# EasyEDA Pro project Haptics_4x4_R4_12VDC.epro

# Schematic Schematic1
Assembly Variant: Basic; Board Name: Board1; Create Date: 2026-09-24; Page Name: P1; Project Name: New Project_2026-09-24_15-26-25; Schematic Name: Schematic1; Update Date: 2026-09-24; Company: 嘉立创EDA; Page Size: A4; Version: V1.0
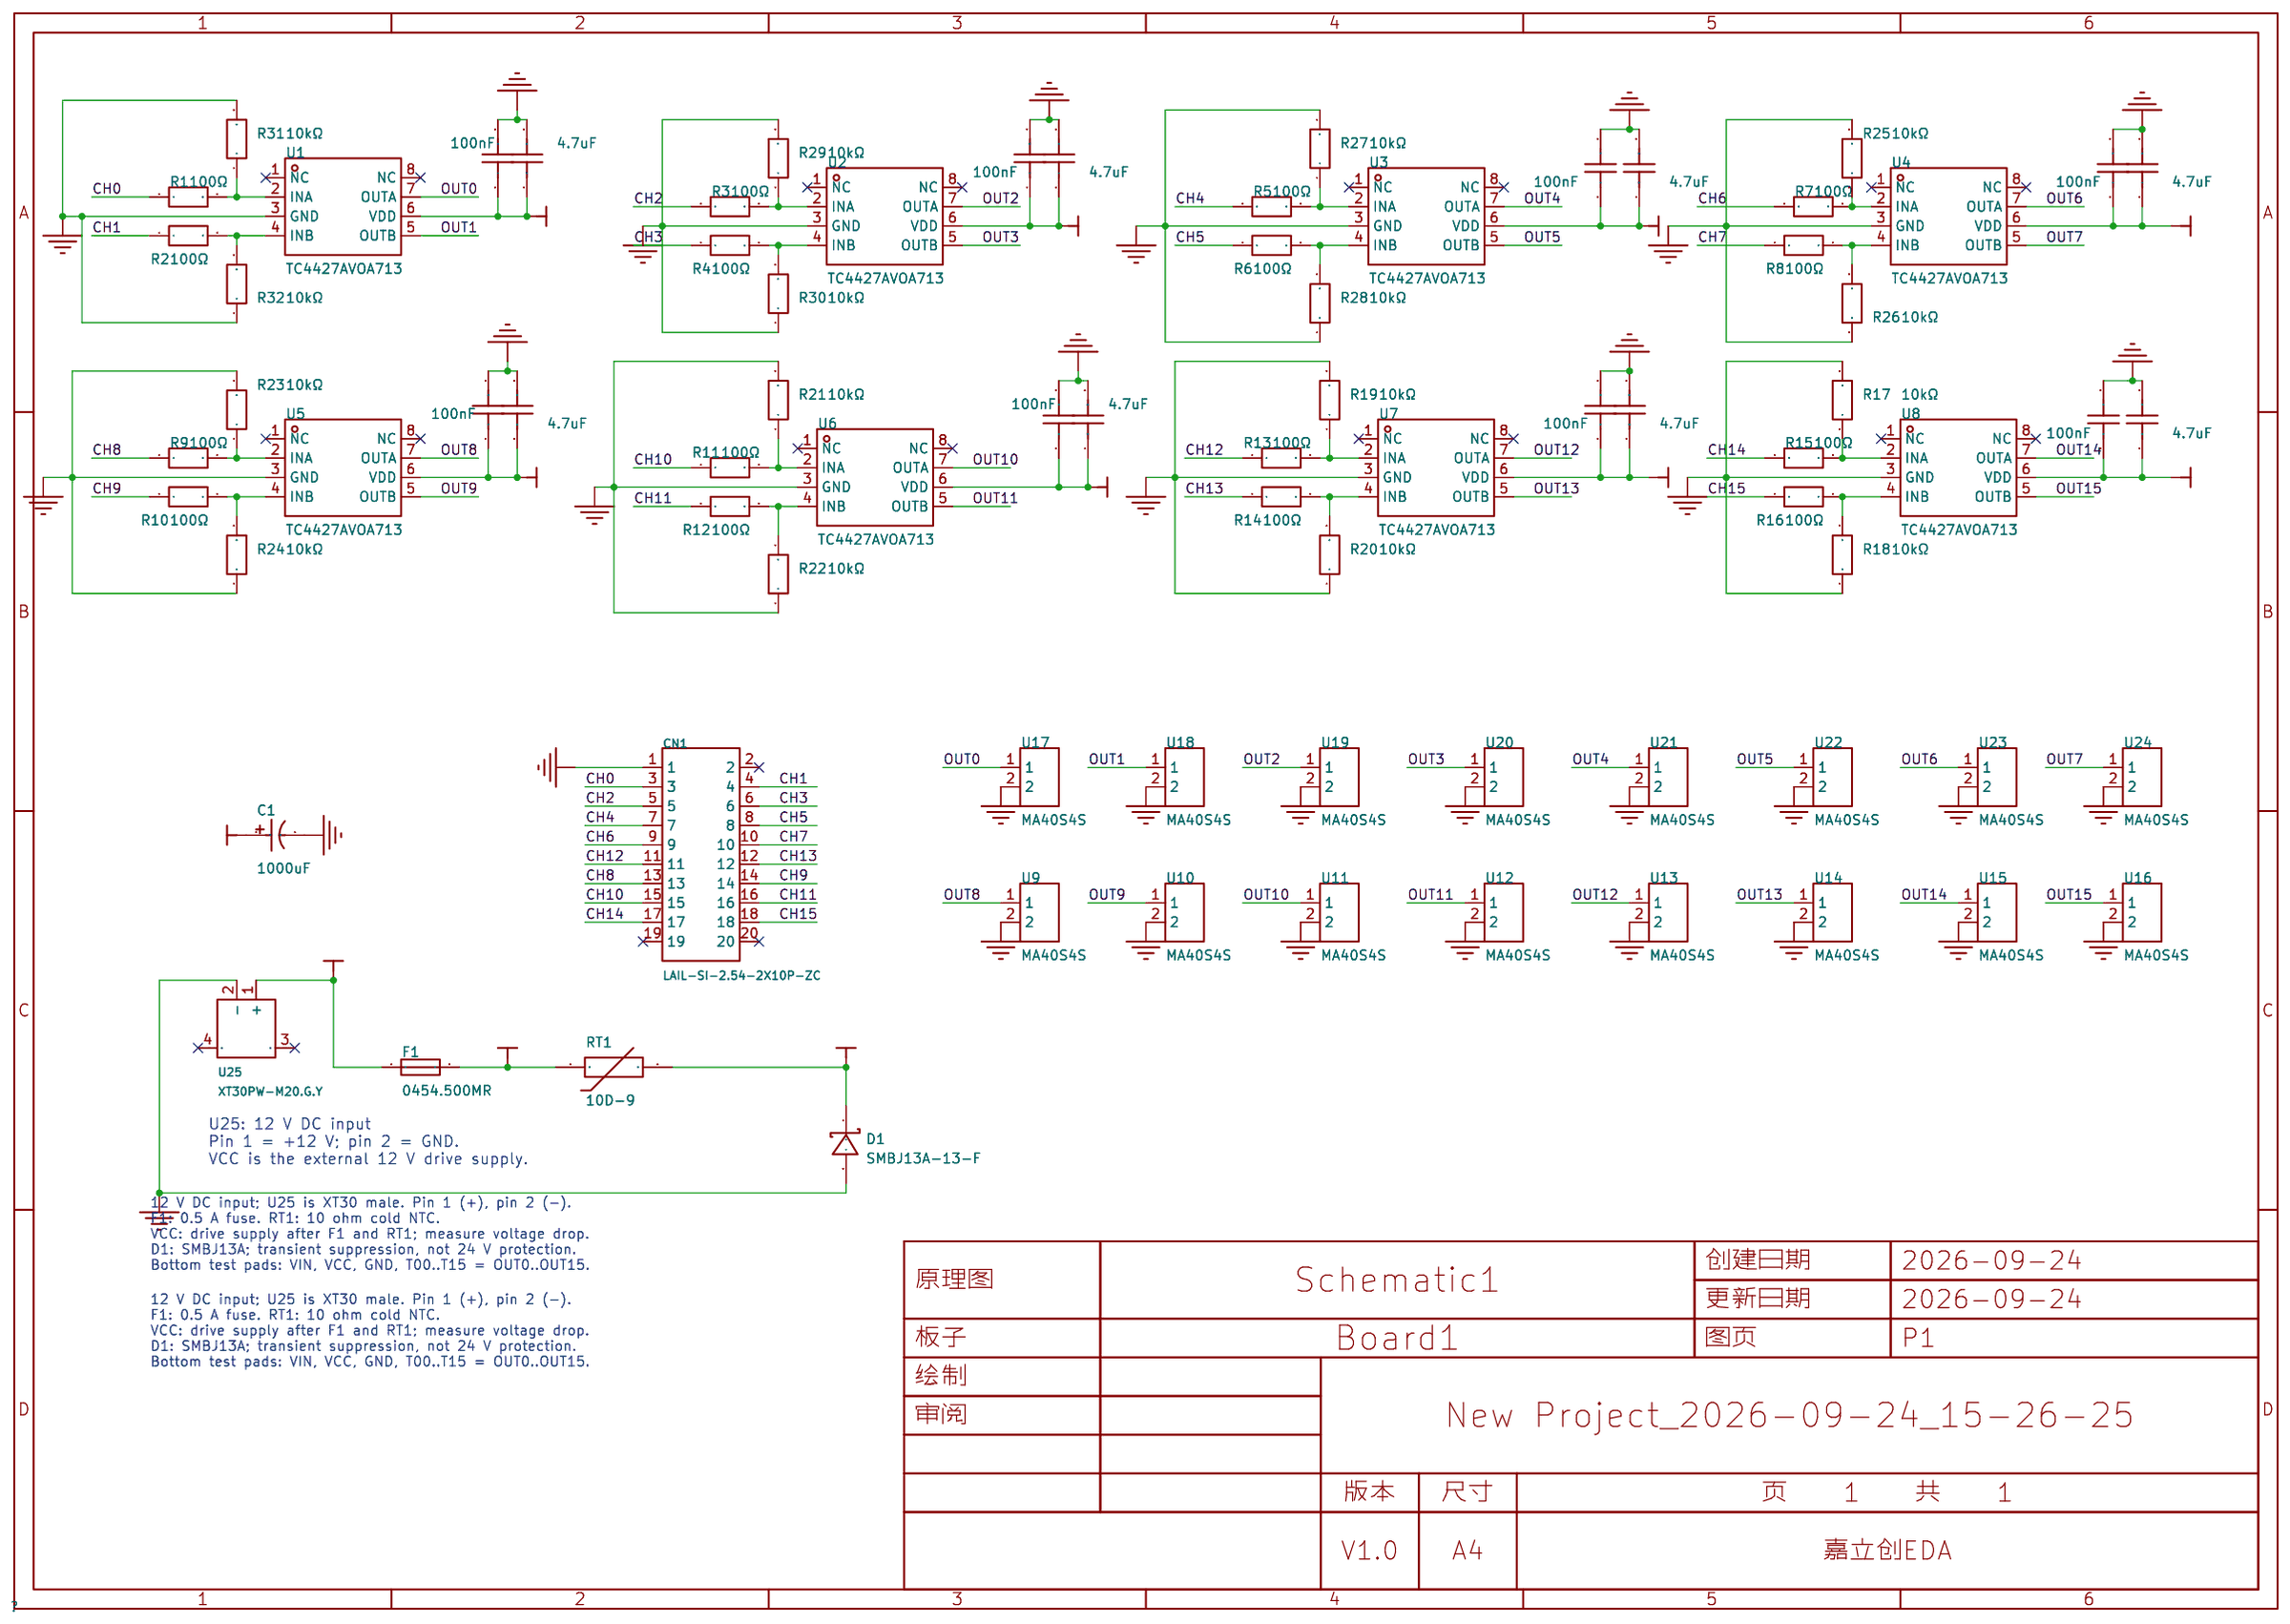
[diagram p0: schematic sheet]

## Parts
C1  1000uF  [CAP-TH_BD12.5-P5.00-D0.6-FD]
C2  100nF  [C0805]
C3  4.7uF  [C0805]
C4  100nF  [C0805]
C5  4.7uF  [C0805]
C6  100nF  [C0805]
C7  4.7uF  [C0805]
C8  100nF  [C0805]
C9  4.7uF  [C0805]
C10  100nF  [C0805]
C11  4.7uF  [C0805]
C12  100nF  [C0805]
C13  4.7uF  [C0805]
C14  100nF  [C0805]
C15  4.7uF  [C0805]
C16  100nF  [C0805]
C17  4.7uF  [C0805]
CN1  LAIL-SI-2.54-2X10P-ZC  [CONN-TH_LAIL-SI-2.54-2X10P-ZC]
D1  SMBJ13A-13-F  [SMB_L4.6-W3.6-LS5.3-RD]
F1  0454.500MR  [FUSE-SMD_L6.1-W2.7]
R1  100Ω  [R0603]
R2  100Ω  [R0603]
R3  100Ω  [R0603]
R4  100Ω  [R0603]
R5  100Ω  [R0603]
R6  100Ω  [R0603]
R7  100Ω  [R0603]
R8  100Ω  [R0603]
R9  100Ω  [R0603]
R10  100Ω  [R0603]
R11  100Ω  [R0603]
R12  100Ω  [R0603]
R13  100Ω  [R0603]
R14  100Ω  [R0603]
R15  100Ω  [R0603]
R16  100Ω  [R0603]
R17  10kΩ  [R0603]
R18  10kΩ  [R0603]
R19  10kΩ  [R0603]
R20  10kΩ  [R0603]
R21  10kΩ  [R0603]
R22  10kΩ  [R0603]
R23  10kΩ  [R0603]
R24  10kΩ  [R0603]
R25  10kΩ  [R0603]
R26  10kΩ  [R0603]
R27  10kΩ  [R0603]
R28  10kΩ  [R0603]
R29  10kΩ  [R0603]
R30  10kΩ  [R0603]
R31  10kΩ  [R0603]
R32  10kΩ  [R0603]
RT1  10D-9  [RES-TH_L10.5-W5.5-P7.50-D0.6-S5.50]
U1  TC4427AVOA713  [SOIC-8_L4.9-W3.9-P1.27-LS6.0-BL]
U2  TC4427AVOA713  [SOIC-8_L4.9-W3.9-P1.27-LS6.0-BL]
U3  TC4427AVOA713  [SOIC-8_L4.9-W3.9-P1.27-LS6.0-BL]
U4  TC4427AVOA713  [SOIC-8_L4.9-W3.9-P1.27-LS6.0-BL]
U5  TC4427AVOA713  [SOIC-8_L4.9-W3.9-P1.27-LS6.0-BL]
U6  TC4427AVOA713  [SOIC-8_L4.9-W3.9-P1.27-LS6.0-BL]
U7  TC4427AVOA713  [SOIC-8_L4.9-W3.9-P1.27-LS6.0-BL]
U8  TC4427AVOA713  [SOIC-8_L4.9-W3.9-P1.27-LS6.0-BL]
U9  MA40S4S  [SENSOR-TH_BD9.9-P5.00-D0.7_MA40S4S]
U10  MA40S4S  [SENSOR-TH_BD9.9-P5.00-D0.7_MA40S4S]
U11  MA40S4S  [SENSOR-TH_BD9.9-P5.00-D0.7_MA40S4S]
U12  MA40S4S  [SENSOR-TH_BD9.9-P5.00-D0.7_MA40S4S]
U13  MA40S4S  [SENSOR-TH_BD9.9-P5.00-D0.7_MA40S4S]
U14  MA40S4S  [SENSOR-TH_BD9.9-P5.00-D0.7_MA40S4S]
U15  MA40S4S  [SENSOR-TH_BD9.9-P5.00-D0.7_MA40S4S]
U16  MA40S4S  [SENSOR-TH_BD9.9-P5.00-D0.7_MA40S4S]
U17  MA40S4S  [SENSOR-TH_BD9.9-P5.00-D0.7_MA40S4S]
U18  MA40S4S  [SENSOR-TH_BD9.9-P5.00-D0.7_MA40S4S]
U19  MA40S4S  [SENSOR-TH_BD9.9-P5.00-D0.7_MA40S4S]
U20  MA40S4S  [SENSOR-TH_BD9.9-P5.00-D0.7_MA40S4S]
U21  MA40S4S  [SENSOR-TH_BD9.9-P5.00-D0.7_MA40S4S]
U22  MA40S4S  [SENSOR-TH_BD9.9-P5.00-D0.7_MA40S4S]
U23  MA40S4S  [SENSOR-TH_BD9.9-P5.00-D0.7_MA40S4S]
U24  MA40S4S  [SENSOR-TH_BD9.9-P5.00-D0.7_MA40S4S]
U25  XT30PW-M20.G.Y  [XT30-TH_XT30PW-M20.G.Y]

## Library data of the parts
C1 = EEUFR1V102: 容值:1000uF;精度:±20%;额定电压:35V;纹波电流:2.6A@100kHz;等效串联电阻(ESR):18mΩ@100kHz;; LCSC Part Name: 1000uF ±20% 35V; Supplier Part: C128518; Manufacturer: PANASONIC(松下); Supplier Footprint: 插件,D12.5xL20mm; JLCPCB Part Class: Extended Part; Datasheet: https://item.szlcsc.com/datasheet/EEUFR1V102/139803.html; Supplier: LCSC; Tolerance: ±20%; Voltage Rating: 35V; Ripple Current: 2.6A@100kHz; Equivalent Series Resistance(ESR): 18mΩ@100kHz; Pin Spacing: 5mm; Diameter: 12.5mm; Height - Seated (Max): 20mm; Lifetime: 10000hrs@105℃; Operating Temperature: -40℃~+105℃; Polarity type: 有极性
C2 C4 C6 C8 C10 C12 C14 C16 = FCC0805B104K500DT: 容值:100nF;精度:±10%;额定电压:50V;温度系数:X7R;; LCSC Part Name: 100nF ±10% 50V; Supplier Part: C5137467; Manufacturer: FOJAN(富捷); Supplier Footprint: 0805; JLCPCB Part Class: Extended Part; Datasheet: https://item.szlcsc.com/datasheet/FCC0805B104K500DT/5746969.html; Supplier: LCSC; Tolerance: ±10%; Voltage Rating: 50V; Temperature Coefficient: X7R; Operating Temperature: -55℃~+125℃
C3 C5 C7 C9 C11 C13 C15 C17 = HGC0805R7475K500NSLJ: 容值:4.7uF;精度:±10%;额定电压:50V;温度系数:X7R;; LCSC Part Name: 4.7uF ±10% 50V; Supplier Part: C7472970; Manufacturer: Chinocera(华瓷); Supplier Footprint: 0805; JLCPCB Part Class: Extended Part; Datasheet: https://item.szlcsc.com/datasheet/HGC0805R7475K500NSLJ/8532817.html; Supplier: LCSC; Tolerance: ±10%; Voltage Rating: 50V; Temperature Coefficient: X7R
CN1 = LAIL-SI-2.54-2X10P-ZC: 连接器类型:简牛座;间距:2.54mm;额定电流:3A;安装方式:直插;行距:2.54mm;排数:2;每排PIN数:10;触头材质:黄铜;触头镀层:金;工作温度:-40℃~+105℃;; LCSC Part Name: 2.54mm 排数:2 每排P数:10; Supplier Part: C55118382; Manufacturer: LAILAN(莱联); Supplier Footprint: 插件,P=2.54mm; JLCPCB Part Class: Extended Part; Datasheet: https://item.szlcsc.com/datasheet/LAIL-SI-2.54-2X10P-ZC/58822692.html; Supplier: LCSC; Connector Type: 简牛座; Pitch: 2.54mm; Current Rating: 3A; Holder Type: 直插; Row Spacing: 2.54mm; Number of Rows: 2; Number of PINs Per Row: 10; Contact Material: 黄铜; Contact Plating: 金; Color: 黑色; Operating Temperature: -40℃~+105℃
D1 = SMBJ13A-13-F: 极性:单向;反向截止电压(Vrwm):13V;钳位电压:21.5V;峰值脉冲电流(Ipp):27.9A;峰值脉冲功率(Ppp):600W;击穿电压(VBR):16.5V;; LCSC Part Name: 单向TVS 13V截止 峰值浪涌电流：27.9A; Supplier Part: C135042; Manufacturer: DIODES(美台); Supplier Footprint: SMB; JLCPCB Part Class: Extended Part; Datasheet: https://item.szlcsc.com/datasheet/SMBJ13A-13-F/146352.html; Supplier: LCSC; Polarity: 单向; Reverse Stand-Off Voltage (Vrwm): 13V; Clamping Voltage: 21.5V; Peak Pulse Current (Ipp): 27.9A; Peak Pulse Power Dissipation (Ppp): 600W; Voltage - Breakdown: 16.5V; Reverse Leakage Current (Ir): 5uA; Number of Channels: 单路; Operating Temperature: -55℃~+150℃; Type: TVS
F1 = 0454.500MR: 类型:贴片式保险丝;额定电流:500mA;额定电压:125V;分断能力:50A;; LCSC Part Name: 125V贴片式保险丝; Supplier Part: C179003; Manufacturer: Littelfuse(美国力特); Supplier Footprint: 2410; JLCPCB Part Class: Extended Part; Datasheet: https://item.szlcsc.com/datasheet/0454.500MR/190396.html; Supplier: LCSC; Type: 贴片式保险丝; Current Rating: 500mA; Voltage Rating (DC): 125V; Operating Temperature: -55℃~+125℃; Melting I2t: 0.24; Interrupt Rating: 50A; Length: 6.1mm; Width: 2.5mm
R1-R16 = PS03W4F1000T5E: 电阻类型:厚膜电阻;阻值:100Ω;精度:±1%;功率:250mW;工作电压:75V;温度系数:±100ppm/℃;; LCSC Part Name: 100Ω ±1% 250mW 厚膜电阻; Supplier Part: C2784878; Manufacturer: UNI-ROYAL(厚声); Supplier Footprint: 0603; JLCPCB Part Class: Extended Part; Datasheet: https://item.szlcsc.com/datasheet/PS03W4F1000T5E/2923334.html; Supplier: LCSC; Type: 厚膜电阻; Tolerance: ±1%; Power(Watts): 250mW; Voltage-Supply(Max): 75V; Temperature Coefficient: ±100ppm/℃; Operating Temperature: -55℃~+155℃
R17-R32 = FRC0603F1002TS: 电阻类型:厚膜电阻;阻值:10kΩ;精度:±1%;功率:100mW;工作电压:75V;温度系数:±100ppm/℃;; LCSC Part Name: 10kΩ ±1% 100mW 厚膜电阻; Supplier Part: C2906982; Manufacturer: FOJAN(富捷); Supplier Footprint: 0603; JLCPCB Part Class: Extended Part; Datasheet: https://item.szlcsc.com/datasheet/FRC0603F1002TS/3180495.html; Supplier: LCSC; Type: 厚膜电阻; Tolerance: ±1%; Power(Watts): 100mW; Voltage-Supply(Max): 75V; Temperature Coefficient: ±100ppm/℃; Operating Temperature: -55℃~+155℃
RT1 = 10D-9: 阻值(25℃):10Ω;B值(25℃/50℃):-;电阻精度:-;功率:-;B值精度:-;最大稳态电流(25℃):1A;; LCSC Part Name: 10Ω; Supplier Part: C70924; Manufacturer: RUILON(瑞隆源); Supplier Footprint: 插件,P=7.5mm; JLCPCB Part Class: Extended Part; Datasheet: https://atta.szlcsc.com/upload/public/pdf/source/20180410/C207392_007A1CB20DB6E487C695D7783FF0F5F9.pdf; Supplier: LCSC; Resistance @ 25℃: 10Ω; Steady State Current (Max): 1A; Operating Temperature: -55℃~+200℃
U1-U8 = TC4427AVOA713: 驱动配置:-;负载类型:MOSFET;驱动通道数:2;灌电流(IOL):1.5A;拉电流(IOH):1.5A;工作电压:4.5V~18V;上升时间(tr):25ns;下降时间(tf):25ns;; LCSC Part Name: 1.5A双路高速功率MOSFET驱动器; Supplier Part: C624944; Manufacturer: MICROCHIP(美国微芯); Supplier Footprint: SOIC-8; JLCPCB Part Class: Extended Part; Datasheet: https://item.szlcsc.com/datasheet/TC4427AVOA713/654791.html; Supplier: LCSC; Load Type: MOSFET; Number of Drivers: 2; Current - Output Low(IOL): 1.5A; Current - Output High(IOH): 1.5A; Voltage - Supply: 4.5V~18V; Rise Time: 25ns; Fall Time: 25ns; Operating Temperature: -40℃~+125℃; Input Logic Level - High: 2.4V; Input Logic Level - Low: 800mV; Quiescent Current(Iq): 100uA
U9-U24 = MA40S4S: 中心频率:40kHz;收发功能类型:接收端;灵敏度:-;类型:开放式;; Supplier Part: C1519281; Manufacturer: muRata(村田); JLCPCB Part Class: Extended Part; Datasheet: https://item.szlcsc.com/datasheet/MA40S4S/1610078.html; Supplier: LCSC; Frequency - Center: 40kHz; Functional Type: 接收端; Type: 开放式; Operating Temperature: -40℃~+85℃; Sound Pressure: 120dB; Maximum Voltage: 20V; Diameter (φD): 9.9mm; Length: 10mm
U25 = XT30PW-M20.G.Y: LCSC Part Name: AMASS(艾迈斯)航模插头电调机插座锂电池连接器 PCB板卧式 金 黄 公头XT30PW-M20.G.Y; Supplier Part: C30170175; Manufacturer: AMASS(艾迈斯); JLCPCB Part Class: Extended Part; Datasheet: https://item.szlcsc.com/datasheet/XT30PW-M20.G.Y/31902142.html; Supplier: LCSC

## Nets
GND: C1.2 C2.2 C3.2 C4.2 C5.2 C6.2 C7.2 C8.2 C9.2 C10.2 C11.2 C12.2 C13.2 C14.2 C15.2 C16.2 C17.2 CN1.1 D1.2(A) R17.2 R18.1 R19.2 R20.1 R21.2 R22.1 R23.2 R24.1 R25.2 R26.1 R27.2 R28.1 R29.2 R30.1 R31.2 R32.1 U1.3(GND) U2.3(GND) U3.3(GND) U4.3(GND) U5.3(GND) U6.3(GND) U7.3(GND) U8.3(GND) U9.2 U10.2 U11.2 U12.2 U13.2 U14.2 U15.2 U16.2 U17.2 U18.2 U19.2 U20.2 U21.2 U22.2 U23.2 U24.2 U25.2(-)
VCC: C1.1 C2.1 C3.1 C4.1 C5.1 C6.1 C7.1 C8.1 C9.1 C10.1 C11.1 C12.1 C13.1 C14.1 C15.1 C16.1 C17.1 D1.1(K) RT1.2 U1.6(VDD) U2.6(VDD) U3.6(VDD) U4.6(VDD) U5.6(VDD) U6.6(VDD) U7.6(VDD) U8.6(VDD)
VIN_12V: F1.1 U25.1(+)
VIN_FUSED: F1.2 RT1.1
CH0: CN1.3 R1.1
CH1: CN1.4 R2.1
CH2: CN1.5 R3.1
CH3: CN1.6 R4.1
CH4: CN1.7 R5.1
CH5: CN1.8 R6.1
CH6: CN1.9 R7.1
CH7: CN1.10 R8.1
CH8: CN1.13 R9.1
CH9: CN1.14 R10.1
CH10: CN1.15 R11.1
CH11: CN1.16 R12.1
CH12: CN1.11 R13.1
CH13: CN1.12 R14.1
CH14: CN1.17 R15.1
CH15: CN1.18 R16.1
OUT0: U1.7(OUTA) U17.1
OUT1: U1.5(OUTB) U18.1
OUT2: U2.7(OUTA) U19.1
OUT3: U2.5(OUTB) U20.1
OUT4: U3.7(OUTA) U21.1
OUT5: U3.5(OUTB) U22.1
OUT6: U4.7(OUTA) U23.1
OUT7: U4.5(OUTB) U24.1
OUT8: U5.7(OUTA) U9.1
OUT9: U5.5(OUTB) U10.1
OUT10: U6.7(OUTA) U11.1
OUT11: U6.5(OUTB) U12.1
OUT12: U7.7(OUTA) U13.1
OUT13: U7.5(OUTB) U14.1
OUT14: U8.7(OUTA) U15.1
OUT15: U8.5(OUTB) U16.1
$1N31: R1.2 R31.1 U1.2(INA)
$1N32: R2.2 R32.2 U1.4(INB)
$1N33: R9.2 R23.1 U5.2(INA)
$1N34: R10.2 R24.2 U5.4(INB)
$1N35: R6.2 R28.2 U3.4(INB)
$1N36: R5.2 R27.1 U3.2(INA)
$1N37: R13.2 R19.1 U7.2(INA)
$1N38: R14.2 R20.2 U7.4(INB)
$1N39: R4.2 R30.2 U2.4(INB)
$1N40: R3.2 R29.1 U2.2(INA)
$1N41: R11.2 R21.1 U6.2(INA)
$1N42: R12.2 R22.2 U6.4(INB)
$1N43: R7.2 R25.1 U4.2(INA)
$1N44: R8.2 R26.2 U4.4(INB)
$1N45: R15.2 R17.1 U8.2(INA)
$1N46: R16.2 R18.2 U8.4(INB)

Not connected (* = marked no-connect by the designer): CN1 2* 19* 20*; U1 1(NC)* 8(NC)*; U2 1(NC)* 8(NC)*; U3 1(NC)* 8(NC)*; U4 1(NC)* 8(NC)*; U5 1(NC)* 8(NC)*; U6 1(NC)* 8(NC)*; U7 1(NC)* 8(NC)*; U8 1(NC)* 8(NC)*; U25 3(G)* 4(G)*

## Notes on the sheet
- U25: 12 V DC input
  Pin 1 = +12 V; pin 2 = GND.
  VCC is the external 12 V drive supply.
- 12 V DC input; U25 is XT30 male. Pin 1 (+), pin 2 (-).
  F1: 0.5 A fuse. RT1: 10 ohm cold NTC.
  VCC: drive supply after F1 and RT1; measure voltage drop.
  D1: SMBJ13A; transient suppression, not 24 V protection.
  Bottom test pads: VIN, VCC, GND, T00..T15 = OUT0..OUT15.
- 12 V DC input; U25 is XT30 male. Pin 1 (+), pin 2 (-).
  F1: 0.5 A fuse. RT1: 10 ohm cold NTC.
  VCC: drive supply after F1 and RT1; measure voltage drop.
  D1: SMBJ13A; transient suppression, not 24 V protection.
  Bottom test pads: VIN, VCC, GND, T00..T15 = OUT0..OUT15.

# Board PCB1
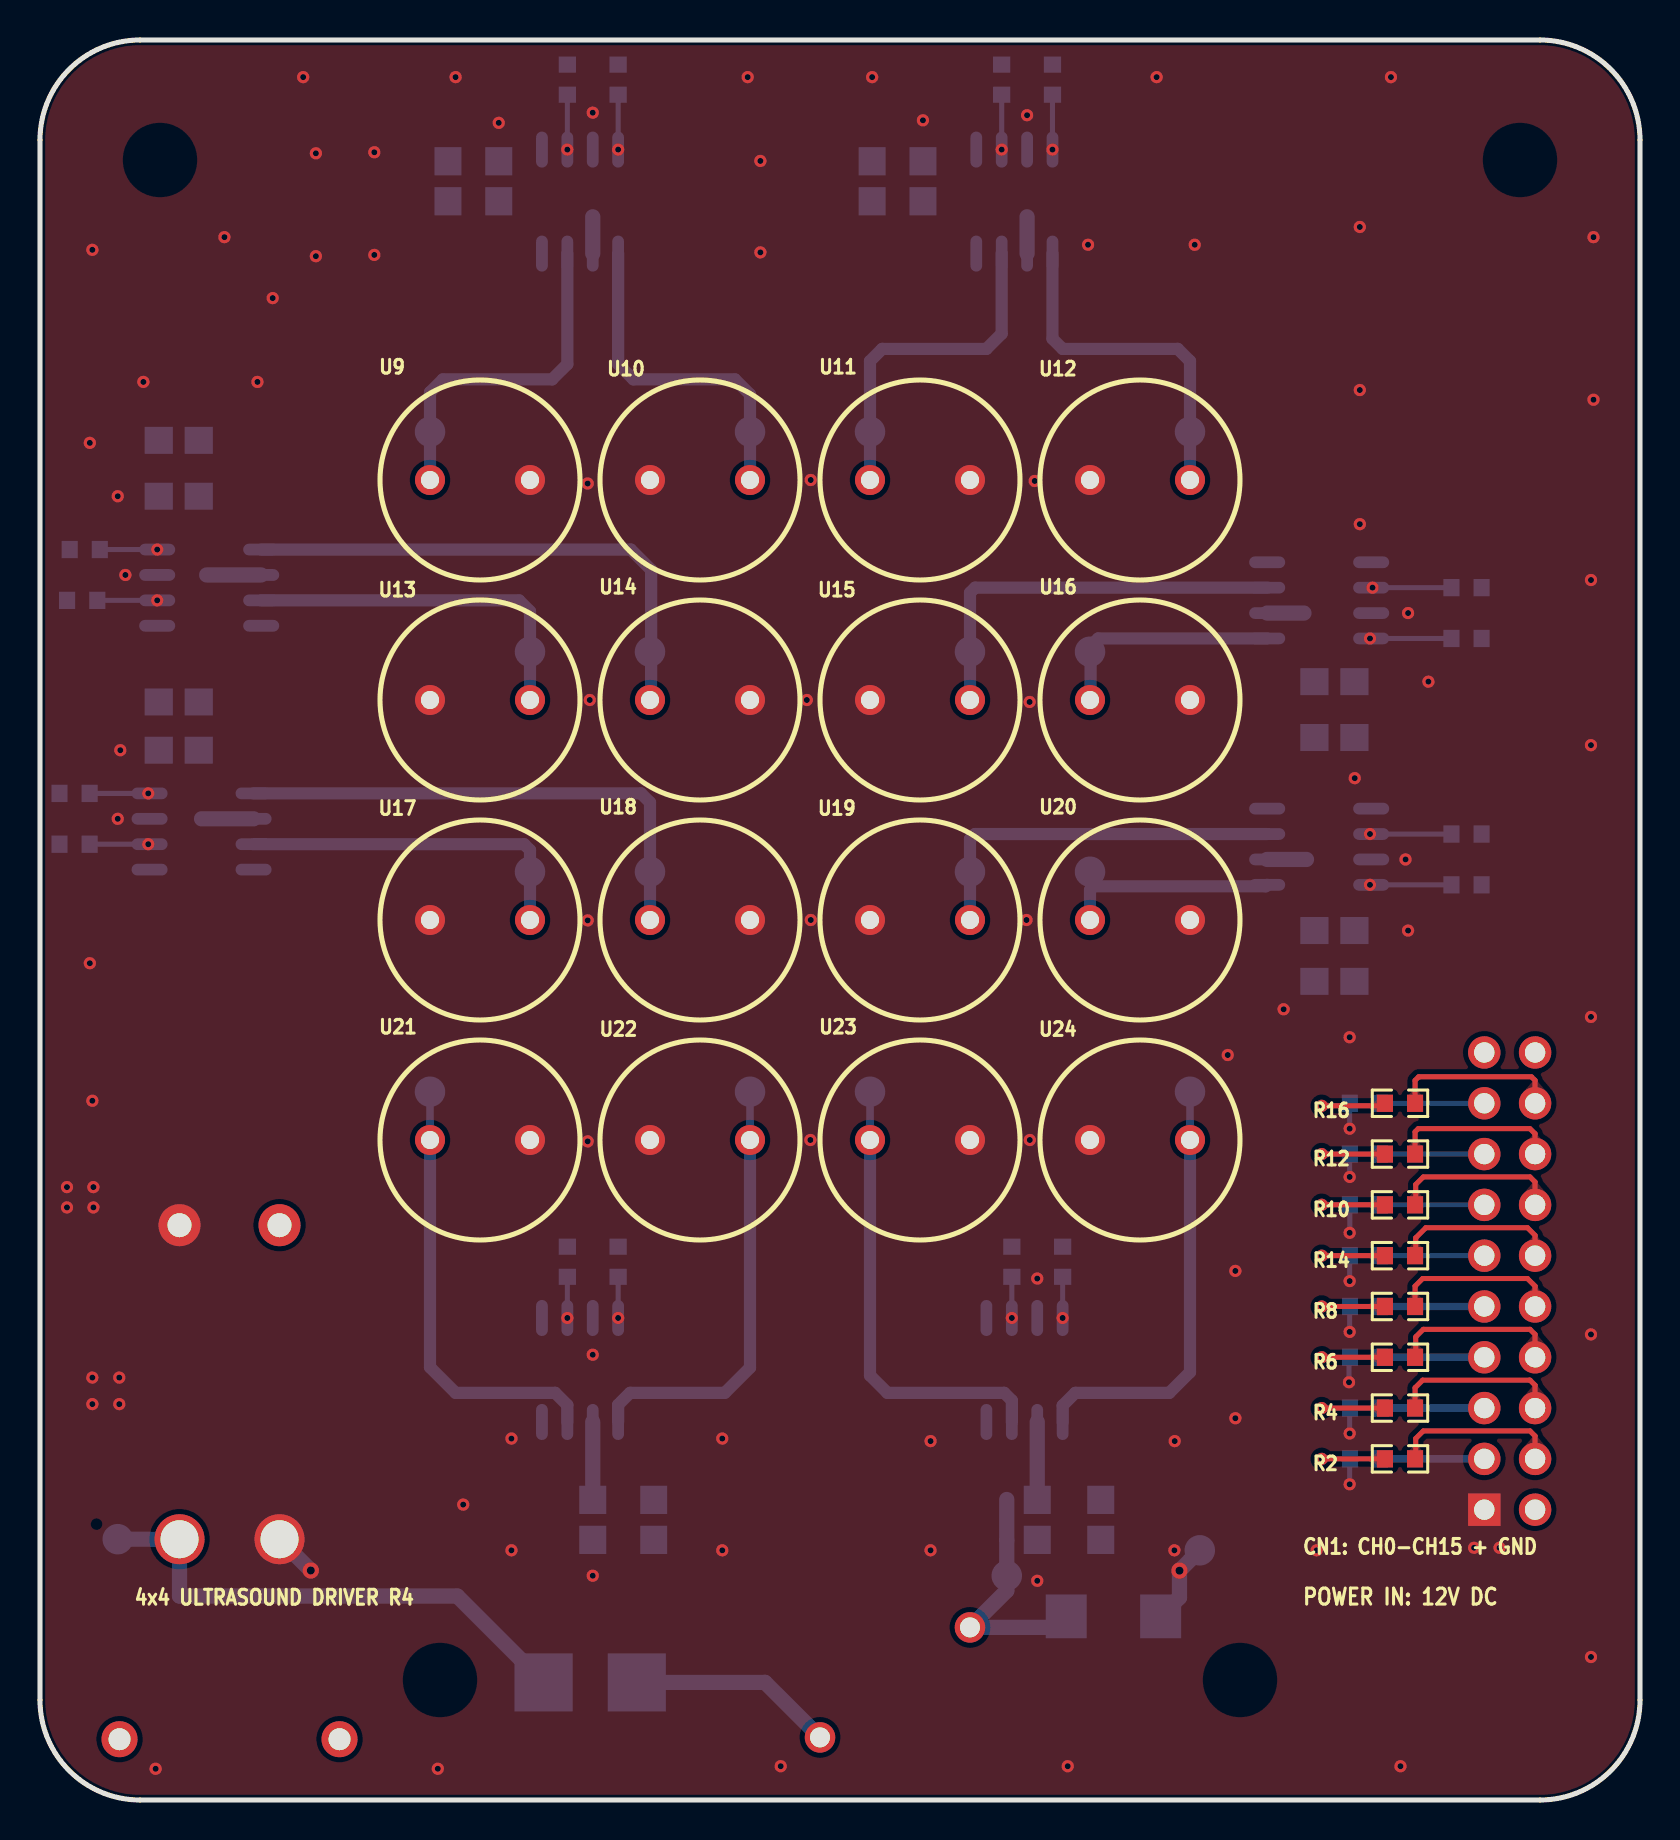
[diagram p1: board, top side]
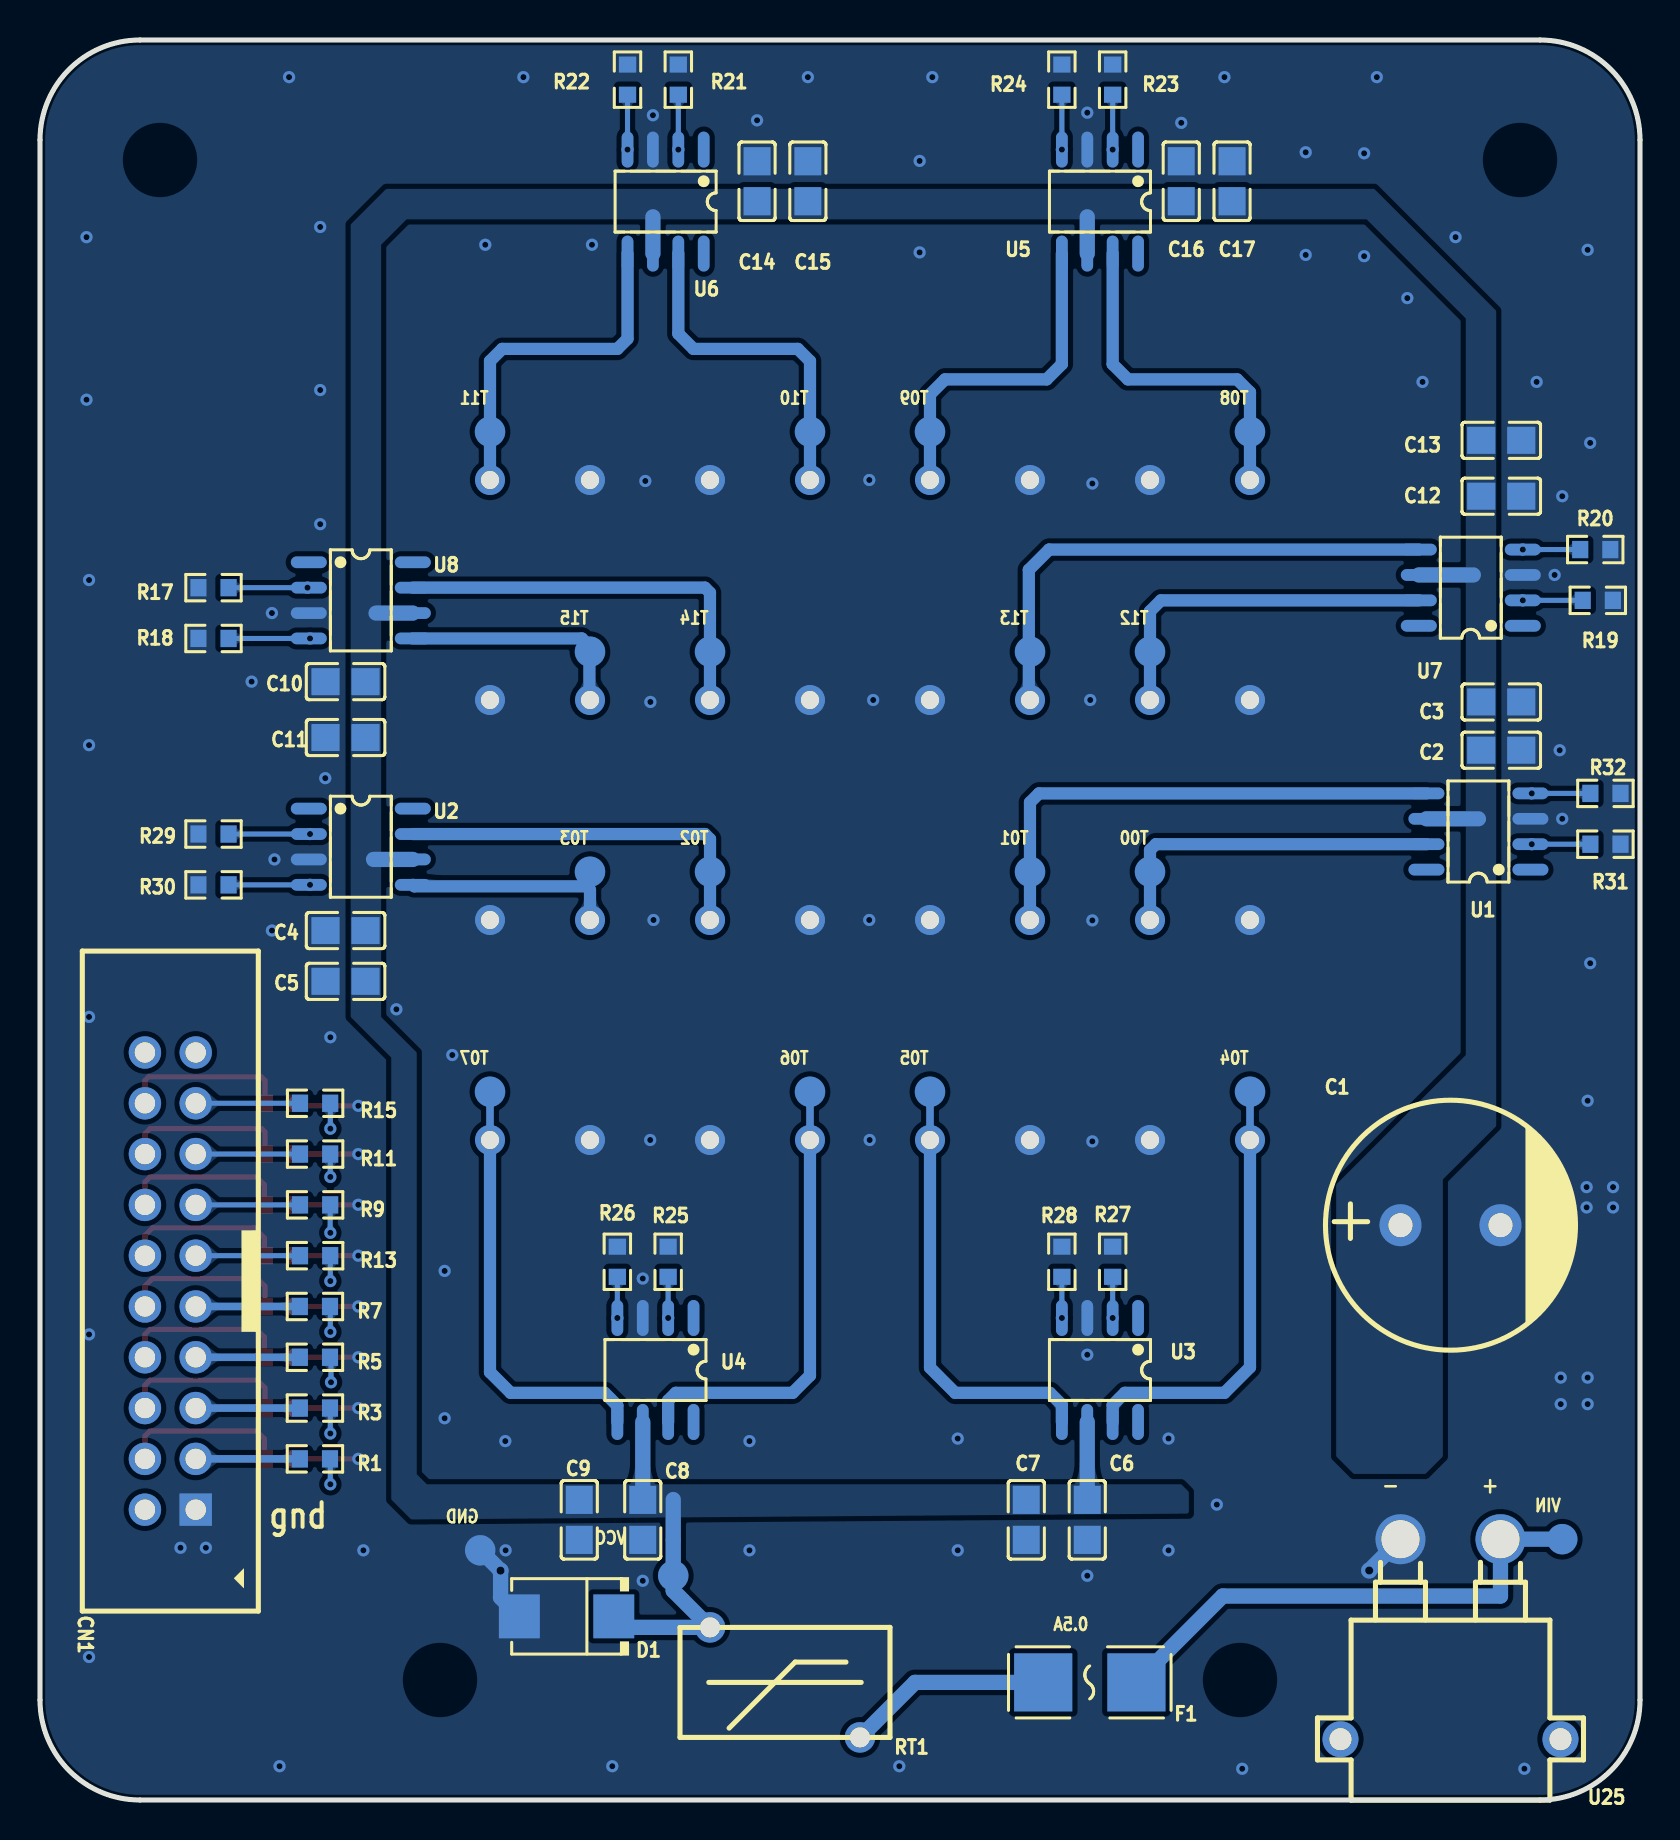
[diagram p2: board, bottom side, seen from below]

Outline 80 x 88 mm; copper layers: Top Layer, Inner1, Inner2, Bottom Layer. Coordinates in mm from the lower left corner of the outline.
Outline path: 0,83 0,5 arc(1.46,1.46) 5,0 75,0 arc(78.54,1.46) 80,5 80,83 arc(78.54,86.54) 75,88 5,88 arc(1.46,86.54) 0,83
Stack: Top Layer 0.035mm Outer layer thickness 1oz / Dielectric1 0.2104mm 7628 RC49% 8.6mil / Inner1 0.0152mm Inner layer thickness / Dielectric2 1.065mm 1.1mm H/HOZ Copper / Inner2 0.0152mm Inner layer thickness / Dielectric3 0.2104mm 7628 RC49% 8.6mil / Bottom Layer 0.035mm Outer layer thickness 1oz

## Design rules (mm)
spacing copperThickness1oz (default): track to track 0.102, other pairs 0.152 to 0.3
spacing copperThickness2oz: track to track 0.203, other pairs 0.152 to 0.3
spacing Plane_innerPlane: track to track 0.102, other pairs 0.152 to 0.3
spacing Plane_innerPlane1: track to track 0.102, other pairs 0.152 to 0.3
spacing Copper_copperRegion: track to track 0.102, other pairs 0.152 to 0.3
spacing Copper_copperRegion1: track to track 0.102, other pairs 0.152 to 0.3
spacing Copper_copperRegion_copperThickness1oz: track to track 0.102, other pairs 0.152 to 0.3
spacing Copper_copperRegion_copperThickness2oz: track to track 0.102, other pairs 0.152 to 0.3
track width copperThickness1oz (default): min 0.127, default 0.254, max 2.54
track width copperThickness2oz: min 0.203, default 0.254, max 2.54
differential pair differentialPair (default): width min 0.127, default 0.254, max 2.54; gap min 0.152, default 0.152
net VCC uses copperRegion_copperThickness1oz
net GND uses copperRegion_copperThickness2oz, copperThickness2oz
pour e800 uses copperRegion1, default
pour e802 uses copperRegion1, default
pour e804 uses copperRegion1, default
region e1 uses Copper_copperRegion_copperThickness2oz
region e2 uses Copper_copperRegion_copperThickness2oz
region e3 uses Copper_copperRegion_copperThickness2oz
region e4 uses Copper_copperRegion_copperThickness2oz
region e5 uses Copper_copperRegion_copperThickness2oz
region e6 uses Copper_copperRegion_copperThickness2oz
region e7 uses Copper_copperRegion_copperThickness2oz
region e8 uses Copper_copperRegion_copperThickness2oz
region e9 uses Copper_copperRegion_copperThickness2oz
region e10 uses Copper_copperRegion_copperThickness2oz
region e11 uses Copper_copperRegion_copperThickness2oz
region e12 uses Copper_copperRegion_copperThickness2oz
region e13 uses Copper_copperRegion_copperThickness2oz
region e14 uses Copper_copperRegion_copperThickness2oz
region e15 uses Copper_copperRegion_copperThickness2oz
region e16 uses Copper_copperRegion_copperThickness2oz
region e17 uses Copper_copperRegion_copperThickness2oz
region e18 uses Copper_copperRegion_copperThickness2oz
region e19 uses Copper_copperRegion_copperThickness2oz
region e20 uses Copper_copperRegion_copperThickness2oz
region e21 uses Copper_copperRegion_copperThickness2oz
region e22 uses Copper_copperRegion_copperThickness2oz
region e23 uses Copper_copperRegion_copperThickness2oz
region e24 uses Copper_copperRegion_copperThickness2oz
region e25 uses Copper_copperRegion_copperThickness2oz
region e26 uses Copper_copperRegion_copperThickness2oz
region e27 uses Copper_copperRegion_copperThickness2oz
region e28 uses Copper_copperRegion_copperThickness2oz
region e29 uses Copper_copperRegion_copperThickness2oz
region e30 uses Copper_copperRegion_copperThickness2oz
region e31 uses Copper_copperRegion_copperThickness2oz
region e32 uses Copper_copperRegion_copperThickness2oz
region e33 uses Copper_copperRegion_copperThickness2oz
region e34 uses Copper_copperRegion_copperThickness2oz
region e35 uses Copper_copperRegion_copperThickness2oz
region e36 uses Copper_copperRegion_copperThickness2oz
region e37 uses Copper_copperRegion_copperThickness2oz
region e38 uses Copper_copperRegion_copperThickness2oz
region e39 uses Copper_copperRegion_copperThickness2oz
region e40 uses Copper_copperRegion_copperThickness2oz
region e41 uses Copper_copperRegion_copperThickness2oz
region e42 uses Copper_copperRegion_copperThickness2oz
region e43 uses Copper_copperRegion_copperThickness2oz
region e44 uses Copper_copperRegion_copperThickness2oz
region e45 uses Copper_copperRegion_copperThickness2oz
region e46 uses Copper_copperRegion_copperThickness2oz
region e47 uses Copper_copperRegion_copperThickness2oz
region e48 uses Copper_copperRegion_copperThickness2oz
region e49 uses Copper_copperRegion_copperThickness2oz
region e50 uses Copper_copperRegion_copperThickness2oz
region e51 uses Copper_copperRegion_copperThickness2oz
region e52 uses Copper_copperRegion_copperThickness2oz
region e53 uses Copper_copperRegion_copperThickness2oz
region e54 uses Copper_copperRegion_copperThickness2oz
region e55 uses Copper_copperRegion_copperThickness2oz
region e56 uses Copper_copperRegion_copperThickness2oz
region e57 uses Copper_copperRegion_copperThickness2oz
region e58 uses Copper_copperRegion_copperThickness2oz
region e59 uses Copper_copperRegion_copperThickness2oz
region e60 uses Copper_copperRegion_copperThickness2oz
region e61 uses Copper_copperRegion_copperThickness2oz
region e62 uses Copper_copperRegion_copperThickness2oz
region e63 uses Copper_copperRegion_copperThickness2oz
region e64 uses Copper_copperRegion_copperThickness2oz
region e65 uses Copper_copperRegion_copperThickness2oz
region e66 uses Copper_copperRegion_copperThickness2oz
region e67 uses Copper_copperRegion_copperThickness2oz
region e68 uses Copper_copperRegion_copperThickness2oz
region e69 uses Copper_copperRegion_copperThickness2oz
region e70 uses Copper_copperRegion_copperThickness2oz
region e71 uses Copper_copperRegion_copperThickness2oz
region e72 uses Copper_copperRegion_copperThickness2oz
region e73 uses Copper_copperRegion_copperThickness2oz
region e74 uses Copper_copperRegion_copperThickness2oz
region e75 uses Copper_copperRegion_copperThickness2oz
region e76 uses Copper_copperRegion_copperThickness2oz
region e77 uses Copper_copperRegion_copperThickness2oz

## Placement (name value [footprint] x y rotation side)
C1  1000uF  [CAP-TH_BD12.5-P5.00-D0.6-FD]  9.48 28.74 180 bottom
C2  100nF  [C0805]  6.94 52.49 180 bottom
C3  4.7uF  [C0805]  6.94 54.9 180 bottom
C4  100nF  [C0805]  64.72 43.47 0 bottom
C5  4.7uF  [C0805]  64.72 40.93 0 bottom
C6  100nF  [C0805]  27.64 14.01 270 bottom
C7  4.7uF  [C0805]  30.69 14.01 270 bottom
C8  100nF  [C0805]  49.86 14.01 270 bottom
C9  4.7uF  [C0805]  53.04 14.01 270 bottom
C10  100nF  [C0805]  64.72 55.92 0 bottom
C11  4.7uF  [C0805]  64.72 53.12 0 bottom
C12  100nF  [C0805]  6.94 65.19 180 bottom
C13  4.7uF  [C0805]  6.94 67.98 180 bottom
C14  100nF  [C0805]  44.15 80.94 90 bottom
C15  4.7uF  [C0805]  41.61 80.94 90 bottom
C16  100nF  [C0805]  22.94 80.94 90 bottom
C17  4.7uF  [C0805]  20.4 80.94 90 bottom
CN1  LAIL-SI-2.54-2X10P-ZC  [CONN-TH_LAIL-SI-2.54-2X10P-ZC]  73.48 25.95 90 bottom
D1  SMBJ13A-13-F  [SMB_L4.6-W3.6-LS5.3-RD]  53.67 9.18 0 bottom
F1  0454.500MR  [FUSE-SMD_L6.1-W2.7]  27.51 5.88 0 bottom
NOREF  -  [Pad_e845]  57.5 68.41 0 top
NOREF#2  -  [Pad_e850]  24.5 46.41 0 top
NOREF#3  -  [Pad_e851]  30.5 46.41 0 top
NOREF#4  -  [Pad_e860]  57.99 12.48 0 top
NOREF#5  -  [Pad_e853]  52.5 46.41 0 top
NOREF#6  -  [Pad_e848]  46.5 57.41 0 top
NOREF#7  -  [Pad_e854]  19.5 35.41 0 top
NOREF#8  -  [Pad_e842]  19.5 68.41 0 top
NOREF#9  -  [Pad_e843]  35.5 68.41 0 top
NOREF#10  -  [Pad_e859]  48.34 11.21 0 top
NOREF#11  -  [Pad_e858]  3.89 13.04 0 top
NOREF#12  -  [Pad_e844]  41.5 68.41 0 top
NOREF#13  -  [Pad_e852]  46.5 46.41 0 top
NOREF#14  -  [Pad_e855]  35.5 35.41 0 top
NOREF#15  -  [Pad_e847]  30.5 57.41 0 top
NOREF#16  -  [Pad_e857]  57.5 35.41 0 top
NOREF#17  -  [Pad_e846]  24.5 57.41 0 top
NOREF#18  -  [Pad_e856]  41.5 35.41 0 top
NOREF#19  -  [Pad_e849]  52.5 57.41 0 top
R1  100Ω  [R0603]  66.25 17.06 180 bottom
R2  100Ω  [R0603]  68 17.06 180 top
R3  100Ω  [R0603]  66.25 19.6 180 bottom
R4  100Ω  [R0603]  68 19.6 180 top
R5  100Ω  [R0603]  66.25 22.14 180 bottom
R6  100Ω  [R0603]  68 22.14 180 top
R7  100Ω  [R0603]  66.25 24.68 180 bottom
R8  100Ω  [R0603]  68 24.68 180 top
R9  100Ω  [R0603]  66.25 29.76 180 bottom
R10  100Ω  [R0603]  68 29.76 180 top
R11  100Ω  [R0603]  66.25 32.3 180 bottom
R12  100Ω  [R0603]  68 32.3 180 top
R13  100Ω  [R0603]  66.25 27.22 180 bottom
R14  100Ω  [R0603]  68 27.22 180 top
R15  100Ω  [R0603]  66.25 34.84 180 bottom
R16  100Ω  [R0603]  68 34.84 180 top
R17  10kΩ  [R0603]  71.32 60.62 0 bottom
R18  10kΩ  [R0603]  71.32 58.08 180 bottom
R19  10kΩ  [R0603]  2.11 59.98 180 bottom
R20  10kΩ  [R0603]  2.24 62.52 0 bottom
R21  10kΩ  [R0603]  48.08 86.02 90 bottom
R22  10kΩ  [R0603]  50.62 86.02 270 bottom
R23  10kΩ  [R0603]  26.37 86.02 90 bottom
R24  10kΩ  [R0603]  28.91 86.02 270 bottom
R25  10kΩ  [R0603]  48.59 26.91 90 bottom
R26  10kΩ  [R0603]  51.13 26.91 270 bottom
R27  10kΩ  [R0603]  26.37 26.91 90 bottom
R28  10kΩ  [R0603]  28.91 26.91 270 bottom
R29  10kΩ  [R0603]  71.32 48.3 0 bottom
R30  10kΩ  [R0603]  71.32 45.76 180 bottom
R31  10kΩ  [R0603]  1.73 47.79 180 bottom
R32  10kΩ  [R0603]  1.73 50.33 0 bottom
RT1  10D-9  [RES-TH_L10.5-W5.5-P7.50-D0.6-S5.50]  42.75 5.88 0 bottom
U1  TC4427AVOA713  [SOIC-8_L4.9-W3.9-P1.27-LS6.0-BL]  8.08 48.42 90 bottom
U2  TC4427AVOA713  [SOIC-8_L4.9-W3.9-P1.27-LS6.0-BL]  63.96 47.66 270 bottom
U3  TC4427AVOA713  [SOIC-8_L4.9-W3.9-P1.27-LS6.0-BL]  27 21.5 0 bottom
U4  TC4427AVOA713  [SOIC-8_L4.9-W3.9-P1.27-LS6.0-BL]  49.23 21.5 0 bottom
U5  TC4427AVOA713  [SOIC-8_L4.9-W3.9-P1.27-LS6.0-BL]  27 79.92 0 bottom
U6  TC4427AVOA713  [SOIC-8_L4.9-W3.9-P1.27-LS6.0-BL]  48.72 79.92 0 bottom
U7  TC4427AVOA713  [SOIC-8_L4.9-W3.9-P1.27-LS6.0-BL]  8.46 60.62 90 bottom
U8  TC4427AVOA713  [SOIC-8_L4.9-W3.9-P1.27-LS6.0-BL]  63.96 59.98 270 bottom
U9  MA40S4S  [SENSOR-TH_BD9.9-P5.00-D0.7_MA40S4S]  22 66 0 top
U10  MA40S4S  [SENSOR-TH_BD9.9-P5.00-D0.7_MA40S4S]  33 66 180 top
U11  MA40S4S  [SENSOR-TH_BD9.9-P5.00-D0.7_MA40S4S]  44 66 0 top
U12  MA40S4S  [SENSOR-TH_BD9.9-P5.00-D0.7_MA40S4S]  55 66 180 top
U13  MA40S4S  [SENSOR-TH_BD9.9-P5.00-D0.7_MA40S4S]  22 55 180 top
U14  MA40S4S  [SENSOR-TH_BD9.9-P5.00-D0.7_MA40S4S]  33 55 0 top
U15  MA40S4S  [SENSOR-TH_BD9.9-P5.00-D0.7_MA40S4S]  44 55 180 top
U16  MA40S4S  [SENSOR-TH_BD9.9-P5.00-D0.7_MA40S4S]  55 55 0 top
U17  MA40S4S  [SENSOR-TH_BD9.9-P5.00-D0.7_MA40S4S]  22 44 180 top
U18  MA40S4S  [SENSOR-TH_BD9.9-P5.00-D0.7_MA40S4S]  33 44 0 top
U19  MA40S4S  [SENSOR-TH_BD9.9-P5.00-D0.7_MA40S4S]  44 44 180 top
U20  MA40S4S  [SENSOR-TH_BD9.9-P5.00-D0.7_MA40S4S]  55 44 0 top
U21  MA40S4S  [SENSOR-TH_BD9.9-P5.00-D0.7_MA40S4S]  22 33 0 top
U22  MA40S4S  [SENSOR-TH_BD9.9-P5.00-D0.7_MA40S4S]  33 33 180 top
U23  MA40S4S  [SENSOR-TH_BD9.9-P5.00-D0.7_MA40S4S]  44 33 0 top
U24  MA40S4S  [SENSOR-TH_BD9.9-P5.00-D0.7_MA40S4S]  55 33 180 top
U25  XT30PW-M20.G.Y  [XT30-TH_XT30PW-M20.G.Y]  9.48 8.04 0 bottom

## Footprints (pads in the part's own frame, mm; a bottom-side part is the same pattern mirrored in y, then rotated)
C0805
  rect 1.41x1.35 smd: 1(-1,0) 2(1,0)
CAP-TH_BD12.5-P5.00-D0.6-FD
  round 2.1 hole 1.2: 1(-2.5,0) 2(2.5,0)
CONN-TH_LAIL-SI-2.54-2X10P-ZC
  rect 1.62x1.62 hole 1.02: 1(-11.43,-1.27)
  round 1.62 hole 1.02: 2(-11.43,1.27) 3(-8.89,-1.27) 4(-8.89,1.27) 5(-6.35,-1.27) 6(-6.35,1.27) 7(-3.81,-1.27) 8(-3.81,1.27) 9(-1.27,-1.27) 10(-1.27,1.27) 11(1.27,-1.27) 12(1.27,1.27) 13(3.81,-1.27) 14(3.81,1.27) 15(6.35,-1.27) 16(6.35,1.27) 17(8.89,-1.27) 18(8.89,1.27) 19(11.43,-1.27) 20(11.43,1.27)
FUSE-SMD_L6.1-W2.7
  rect 2.91x2.905 smd: 1(-2.33,0) 2(2.33,0)
Pad_e842
  round 1.524 smd far side: T08(0,0)
Pad_e843
  round 1.524 smd far side: T09(0,0)
Pad_e844
  round 1.524 smd far side: T10(0,0)
Pad_e845
  round 1.524 smd far side: T11(0,0)
Pad_e846
  round 1.524 smd far side: T12(0,0)
Pad_e847
  round 1.524 smd far side: T13(0,0)
Pad_e848
  round 1.524 smd far side: T14(0,0)
Pad_e849
  round 1.524 smd far side: T15(0,0)
Pad_e850
  round 1.524 smd far side: T00(0,0)
Pad_e851
  round 1.524 smd far side: T01(0,0)
Pad_e852
  round 1.524 smd far side: T02(0,0)
Pad_e853
  round 1.524 smd far side: T03(0,0)
Pad_e854
  round 1.524 smd far side: T04(0,0)
Pad_e855
  round 1.524 smd far side: T05(0,0)
Pad_e856
  round 1.524 smd far side: T06(0,0)
Pad_e857
  round 1.524 smd far side: T07(0,0)
Pad_e858
  round 1.524 smd far side: VIN(0,0)
Pad_e859
  round 1.524 smd far side: VCC(0,0)
Pad_e860
  round 1.524 smd far side: GND(0,0)
R0603
  rect 0.806x0.864 smd: 1(-0.753,0) 2(0.753,0)
RES-TH_L10.5-W5.5-P7.50-D0.6-S5.50
  round 1.524 hole 1: 1(-3.749,2.75) 2(3.749,-2.75)
SENSOR-TH_BD9.9-P5.00-D0.7_MA40S4S
  round 1.5 hole 0.9: 1(-2.5,0) 2(2.5,0)
SMB_L4.6-W3.6-LS5.3-RD
  rect 2.047x2.192 smd: 1(-2.361,0) 2(2.361,0)
SOIC-8_L4.9-W3.9-P1.27-LS6.0-BL
  oval 0.588x1.8 smd: 1(-1.905,-2.6) 2(-0.635,-2.6) 3(0.635,-2.6) 4(1.905,-2.6) 5(1.905,2.6) 6(0.635,2.6) 7(-0.635,2.6) 8(-1.905,2.6)
XT30-TH_XT30PW-M20.G.Y
  round 2.5 hole 1.9: 1(-2.5,-5) 2(2.5,-5)
  round 1.8 hole 1.1: 3(-5.5,5) 4(5.5,5)

## Nets
GND: C1.2 C2.2 C3.2 C4.2 C5.2 C6.2 C7.2 C8.2 C9.2 C10.2 C11.2 C12.2 C13.2 C14.2 C15.2 C16.2 C17.2 CN1.1 D1.2 NOREF#4.GND R17.2 R18.1 R19.2 R20.1 R21.2 R22.1 R23.2 R24.1 R25.2 R26.1 R27.2 R28.1 R29.2 R30.1 R31.2 R32.1 U1.3 U2.3 U3.3 U4.3 U5.3 U6.3 U7.3 U8.3 U9.2 U10.2 U11.2 U12.2 U13.2 U14.2 U15.2 U16.2 U17.2 U18.2 U19.2 U20.2 U21.2 U22.2 U23.2 U24.2 U25.2
VCC: C1.1 C2.1 C3.1 C4.1 C5.1 C6.1 C7.1 C8.1 C9.1 C10.1 C11.1 C12.1 C13.1 C14.1 C15.1 C16.1 C17.1 D1.1 NOREF#10.VCC RT1.2 U1.6 U2.6 U3.6 U4.6 U5.6 U6.6 U7.6 U8.6
VIN_12V: F1.1 NOREF#11.VIN U25.1
VIN_FUSED: F1.2 RT1.1
CH0: CN1.3 R1.1
CH1: CN1.4 R2.1
CH2: CN1.5 R3.1
CH3: CN1.6 R4.1
CH4: CN1.7 R5.1
CH5: CN1.8 R6.1
CH6: CN1.9 R7.1
CH7: CN1.10 R8.1
CH8: CN1.13 R9.1
CH9: CN1.14 R10.1
CH10: CN1.15 R11.1
CH11: CN1.16 R12.1
CH12: CN1.11 R13.1
CH13: CN1.12 R14.1
CH14: CN1.17 R15.1
CH15: CN1.18 R16.1
OUT0: NOREF#2.T00 U1.7 U17.1
OUT1: NOREF#3.T01 U1.5 U18.1
OUT2: NOREF#13.T02 U2.7 U19.1
OUT3: NOREF#5.T03 U2.5 U20.1
OUT4: NOREF#7.T04 U3.7 U21.1
OUT5: NOREF#14.T05 U3.5 U22.1
OUT6: NOREF#18.T06 U4.7 U23.1
OUT7: NOREF#16.T07 U4.5 U24.1
OUT8: NOREF#8.T08 U5.7 U9.1
OUT9: NOREF#9.T09 U5.5 U10.1
OUT10: NOREF#12.T10 U6.7 U11.1
OUT11: NOREF.T11 U6.5 U12.1
OUT12: NOREF#17.T12 U7.7 U13.1
OUT13: NOREF#15.T13 U7.5 U14.1
OUT14: NOREF#6.T14 U8.7 U15.1
OUT15: NOREF#19.T15 U8.5 U16.1
$1N31: R1.2 R31.1 U1.2
$1N32: R2.2 R32.2 U1.4
$1N33: R9.2 R23.1 U5.2
$1N34: R10.2 R24.2 U5.4
$1N35: R6.2 R28.2 U3.4
$1N36: R5.2 R27.1 U3.2
$1N37: R13.2 R19.1 U7.2
$1N38: R14.2 R20.2 U7.4
$1N39: R4.2 R30.2 U2.4
$1N40: R3.2 R29.1 U2.2
$1N41: R11.2 R21.1 U6.2
$1N42: R12.2 R22.2 U6.4
$1N43: R7.2 R25.1 U4.2
$1N44: R8.2 R26.2 U4.4
$1N45: R15.2 R17.1 U8.2
$1N46: R16.2 R18.2 U8.4

Pads without a net: CN1 2 19 20; U1 1 8; U2 1 8; U3 1 8; U4 1 8; U5 1 8; U6 1 8; U7 1 8; U8 1 8; U25 3 4

## Via types
v1: diameter 0.61, hole 0.305, Top Layer to Bottom Layer, 123 vias
v2: diameter 0.813, hole 0.406, Top Layer to Bottom Layer, 2 vias

## Routing (per net, layer and track width the routed paths; a pad name or vN(x,y) marks a point on that pad's centre or on a via; arc(x,y) is an arc through that point)
GND: length 6.3
  Bottom Layer w0.762: NOREF#4.GND v2(56.97,11.47) 56.97,10.12 D1.2 ; U25.2 v2(13.54,11.48)
  vias: v1(1.35,30.64) v1(1.35,29.63) v1(2.49,67.86) v1(2.49,41.84) v1(2.62,77.51) v1(2.62,34.96) v1(2.62,21.12) v1(2.62,19.79) v1(2.67,30.64) v1(2.67,29.63) v1(3.89,65.19) v1(3.89,49.06) v1(4.02,52.49) v1(3.96,21.12) v1(3.96,19.79) v1(4.27,61.25) v1(5.17,70.9) v1(5.78,1.56) v1(9.22,78.14) v1(10.87,70.9) v1(11.64,75.09) v1(13.16,86.14) v1(13.79,82.33) v1(13.79,77.19) v1(16.72,82.39) v1(16.72,77.25) v1(19.89,1.56) v1(20.78,86.14) v1(21.16,14.77) v1(22.94,83.86) v1(23.57,18.07) v1(23.57,12.48) v1(27.38,65.82) v1(27.38,43.98) v1(27.38,32.93) v1(27.49,55) v1(27.64,84.37) v1(27.64,22.26) v1(27.64,11.21) v1(34.11,18.07) v1(34.11,12.48) v1(35.38,86.14) v1(36.02,81.95) v1(36.02,77.38) v1(37.03,1.69) v1(38.34,55) v1(38.54,66) v1(38.54,44) v1(38.52,33) v1(41.61,86.14) v1(44.15,83.98) v1(44.53,17.94) v1(44.53,12.48) v1(49.33,44) v1(49.35,84.24) v1(49.48,54.9) v1(49.49,33) v1(49.74,65.95) v1(49.86,26.07) v1(49.86,10.96) v1(51.39,1.69) v1(52.4,77.76) v1(55.83,86.14) v1(56.74,17.94) v1(56.72,12.48) v1(57.74,77.76) v1(59.39,37.25) v1(59.77,26.45) v1(59.77,19.09) v1(62.18,39.53) v1(63.83,12.48) v1(65.48,38.14) v1(65.74,51.09) v1(65.99,78.65) v1(65.99,70.5) v1(65.99,63.79) v1(67.55,86.14) v1(68.02,1.69) v1(68.28,47.03) v1(68.4,59.35) v1(68.4,43.47) v1(69.42,55.92) v1(71.71,12.61) v1(72.98,12.61) v1(77.55,61) v1(77.55,52.74) v1(77.55,39.15) v1(77.55,23.28) v1(77.55,7.15) v1(77.68,78.14) v1(77.68,70.02)
VCC: length 32.8
  Bottom Layer w0.762: 27.64,77.32 27.64,79.16 ; U3.6 C6.1 ; U4.6 C8.1 ; 48.34,15.02 48.34,10.47 46.5,8.63 50.76,8.63 D1.1 ; 10.68,49.06 8.08,49.06 ; U8.6 63.2,59.35 ; 49.35,77.32 49.35,79.16 ; U2.6 63.32,47.03 ; U7.6 8.33,61.25
VIN_12V: length 25.9
  Bottom Layer w0.762: NOREF#11.VIN U25.1 6.98,10.2 20.86,10.2 F1.1
VIN_FUSED: length 10.3
  Bottom Layer w0.762: F1.2 36.25,5.88 39,3.13
CH0: length 5.2
  Bottom Layer w0.381: R1.1 CN1.3
CH1: length 8.4
  Top Layer w0.254: R2.1 68.78,17.09 68.78,18.07 69.17,18.45 74.5,18.45 74.75,18.2 CN1.4
CH2: length 5.2
  Bottom Layer w0.381: R3.1 CN1.5
CH3: length 8.4
  Top Layer w0.254: CN1.6 74.75,20.74 74.5,20.99 69.13,20.99 68.75,20.61 R4.1
CH4: length 5.2
  Bottom Layer w0.381: R5.1 CN1.7
CH5: length 8.4
  Top Layer w0.254: R6.1 68.78,22.17 68.78,23.15 69.17,23.53 74.5,23.53 74.75,23.28 CN1.8
CH6: length 5.2
  Bottom Layer w0.381: R7.1 CN1.9
CH7: length 8.3
  Top Layer w0.254: CN1.10 74.75,25.69 74.37,26.07 69.13,26.07 68.75,25.69 R8.1
CH8: length 5.2
  Bottom Layer w0.254: R9.1 CN1.13
CH9: length 8.4
  Top Layer w0.254: CN1.14 74.75,30.9 74.5,31.15 69.17,31.15 68.78,30.77 68.78,29.79 R10.1
CH10: length 5.2
  Bottom Layer w0.254: R11.1 CN1.15
CH11: length 8.3
  Top Layer w0.254: R12.1 68.75,33.41 68.91,33.57 74.5,33.57 74.75,33.31 CN1.16
CH12: length 5.2
  Bottom Layer w0.254: R13.1 CN1.11
CH13: length 8.3
  Top Layer w0.254: R14.1 68.78,27.25 68.78,28.11 69.29,28.61 74.37,28.61 74.75,28.23 CN1.12
CH14: length 5.2
  Bottom Layer w0.254: R15.1 CN1.17
CH15: length 8.4
  Top Layer w0.254: CN1.18 74.75,35.98 74.57,36.16 68.93,36.16 68.75,35.98 R16.1
OUT0: length 17.4
  Bottom Layer w0.61: 10.68,47.79 24.21,47.79 24.5,47.5 NOREF#2.T00 U17.1
OUT1: length 25.9
  Bottom Layer w0.61: 10.68,50.33 30.05,50.33 30.5,49.88 NOREF#3.T01 U18.1
OUT2: length 19
  Bottom Layer w0.61: U2.7 46.75,48.3 46.5,48.04 NOREF#13.T02 U19.1
OUT3: length 11.4
  Bottom Layer w0.381: 52.5,45.5 NOREF#5.T03
  Bottom Layer w0.61: U2.5 61.28,45.68 52.68,45.68 52.5,45.5 U20.1
OUT4: length 22.3
  Bottom Layer w0.381: U21.1 NOREF#7.T04
  Bottom Layer w0.61: U3.7 26.37,19.75 25.76,20.36 20.78,20.36 19.5,21.64 U21.1
OUT5: length 22
  Bottom Layer w0.381: U22.1 NOREF#14.T05
  Bottom Layer w0.61: U22.1 35.5,21.62 34.24,20.36 29.51,20.36 28.91,19.76 U3.5
OUT6: length 22.9
  Bottom Layer w0.381: U23.1 NOREF#18.T06
  Bottom Layer w0.61: U4.7 48.59,19.98 48.21,20.36 42.37,20.36 41.5,21.23 U23.1
OUT7: length 21.9
  Bottom Layer w0.381: U24.1 NOREF#16.T07
  Bottom Layer w0.61: U24.1 57.5,21.39 56.47,20.36 51.77,20.36 51.13,19.72 U4.5
OUT8: length 17.4
  Bottom Layer w0.61: 26.37,77.32 26.37,71.79 25.6,71.03 20.14,71.03 19.5,70.39 U9.1
OUT9: length 17
  Bottom Layer w0.61: U10.1 NOREF#9.T09 35.5,70.28 34.75,71.03 29.67,71.03 28.91,71.79 28.91,77.32
OUT10: length 17.1
  Bottom Layer w0.61: 48.08,77.32 48.08,73.32 47.32,72.56 42.11,72.56 41.5,71.95 NOREF#12.T10 U11.1
OUT11: length 17.5
  Bottom Layer w0.61: U12.1 NOREF.T11 57.5,71.95 56.89,72.56 51.13,72.56 50.62,73.06 50.62,77.32
OUT12: length 18.1
  Bottom Layer w0.61: U7.7 23.95,59.98 24.5,59.44 NOREF#17.T12 U13.1
OUT13: length 26.4
  Bottom Layer w0.61: U7.5 29.54,62.52 30.56,61.51 30.56,55.06 U14.1
OUT14: length 20.3
  Bottom Layer w0.61: U15.1 NOREF#6.T14 46.5,60.36 46.75,60.62 U8.7
OUT15: length 11.7
  Bottom Layer w0.61: U16.1 52.53,55.03 52.53,57.7 52.91,58.08 U8.5
$1N31: length 94.5
  Inner1 w0.254: v1(5.41,47.79) 14.94,47.79 15.7,47.03 15.7,18.07 17.98,15.79 v1(65.48,15.79)
  Bottom Layer w0.254: v1(65.48,15.79) 65.48,17.04 R1.2 ; v1(5.41,47.79) R31.1
$1N32: length 96.8
  Top Layer w0.254: v1(64.09,17.06) 67.27,17.06
  Inner1 w0.254: v1(64.09,17.06) 18.49,17.06 17.1,18.45 17.1,49.44 16.21,50.33 v1(5.41,50.33)
  Bottom Layer w0.254: U1.4 R32.2
$1N33: length 96.8
  Inner1 w0.254: v1(65.48,28.36) 63.83,28.36 63.53,28.67 63.53,29.3 63.07,29.76 26.73,29.76 26.37,30.12 v1(26.37,82.52)
  Bottom Layer w0.254: R9.2 65.49,28.37 v1(65.48,28.36) ; v1(26.37,82.52) R23.1
$1N34: length 93.3
  Top Layer w0.254: 67.27,29.76 67.26,29.76 v1(64.09,29.76)
  Inner1 w0.254: v1(28.91,82.52) 28.91,30.77 29.16,30.52 63.33,30.52 v1(64.09,29.76)
  Bottom Layer w0.254: v1(28.91,82.52) R24.2
$1N35: length 41.9
  Top Layer w0.254: v1(64.09,22.14) 67.27,22.14
  Inner1 w0.254: v1(28.91,24.1) 28.91,22.9 29.67,22.14 v1(64.09,22.14)
  Bottom Layer w0.254: v1(28.91,24.1) R28.2
$1N36: length 45.1
  Inner1 w0.254: v1(65.45,20.89) 27.24,20.89 26.37,21.75 v1(26.37,24.1)
  Bottom Layer w0.254: v1(26.37,24.1) R27.1 ; v1(65.45,20.89) 65.45,22.09 R5.2
$1N37: length 96.1
  Inner1 w0.254: v1(5.86,59.98) 20.27,59.98 21.03,59.22 21.03,28.23 21.29,27.98 61.42,27.98 63.45,25.95 v1(65.48,25.95)
  Bottom Layer w0.254: R13.2 65.48,27.21 v1(65.48,25.95) ; v1(5.86,59.98) R19.1
$1N38: length 98.2
  Top Layer w0.254: v1(64.09,27.22) 67.27,27.22
  Inner1 w0.254: v1(5.86,62.52) 21.41,62.52 21.92,62.01 21.92,29.12 22.18,28.87 62.44,28.87 v1(64.09,27.22)
  Bottom Layer w0.254: v1(5.86,62.52) R20.2
$1N39: length 37
  Top Layer w0.254: v1(64.09,19.6) 67.27,19.6
  Inner1 w0.254: v1(64.09,19.6) 67.13,19.6 67.51,19.98 67.51,44.74 v1(66.5,45.76)
  Bottom Layer w0.254: R30.2 v1(66.5,45.76)
$1N40: length 41.7
  Inner1 w0.254: v1(65.48,18.33) 68.78,18.33 69.67,19.22 69.67,47.54 68.91,48.3 v1(66.5,48.3)
  Bottom Layer w0.254: R29.1 v1(66.5,48.3) ; R3.2 65.48,19.58 v1(65.48,18.33)
$1N41: length 71.3
  Inner1 w0.254: v1(48.08,82.52) 48.08,81.7 48.34,81.44 59.77,81.44 60.53,80.68 60.53,32.68 62.05,31.15 v1(65.48,31.15)
  Bottom Layer w0.254: R11.2 65.48,32.29 65.48,31.03 ; v1(48.08,82.52) R21.1
$1N42: length 68.4
  Top Layer w0.254: v1(64.09,32.3) 67.27,32.3
  Inner1 w0.254: v1(50.62,82.52) 60.34,82.52 61.55,81.32 61.55,33.19 62.31,32.42 63.96,32.42 v1(64.09,32.3)
  Bottom Layer w0.254: v1(50.62,82.52) R22.2
$1N43: length 20.8
  Inner1 w0.254: v1(48.59,24.1) 48.59,23.66 48.85,23.41 v1(65.48,23.41)
  Bottom Layer w0.254: v1(65.48,23.41) 65.48,24.66 R7.2 ; v1(48.59,24.1) R25.1
$1N44: length 18.4
  Top Layer w0.254: v1(64.09,24.68) 67.27,24.68
  Inner1 w0.254: v1(51.13,24.1) 51.71,24.68 v1(64.09,24.68)
  Bottom Layer w0.254: v1(51.13,24.1) R26.2
$1N45: length 37.9
  Inner1 w0.254: v1(66.63,60.62) 63.32,60.62 63.14,60.44 63.14,33.75 63.32,33.57 v1(65.48,33.57)
  Bottom Layer w0.254: U8.2 v1(66.63,60.62) R17.1 ; R15.2 65.48,34.83 v1(65.48,33.57)
$1N46: length 32.9
  Top Layer w0.254: v1(64.09,34.71) 67.14,34.71 67.27,34.84
  Inner1 w0.254: v1(66.5,58.08) 64.47,58.08 64.09,57.7 v1(64.09,34.71)
  Bottom Layer w0.254: R18.2 v1(66.5,58.08)

## Copper pours and planes (outline as drawn; the poured copper is in the pictures)
GND on Top Layer: -14.65,94.02 103.96,94.02 103.96,-4.53 -14.65,-4.53
GND on Bottom Layer: -17.96,98.59 98.63,98.59 98.63,-5.42 -17.96,-5.42
GND on Inner2: 0.26,87.74 79.74,87.74 79.74,0.26 0.26,0.26
VCC on Bottom Layer: 22.56,14.32 22.56,15.41 22.94,15.79 60.66,15.79 61.16,16.29 61.16,37.38 62.94,39.15 62.94,77.76 61.67,79.03 13.67,79.03 8.71,74.08 8.71,37.25 15.19,30.77 15.19,17.18 14.31,16.3 10.73,16.3 9.86,17.17 9.86,31.03 7.19,33.69 7.19,74.46 13.29,80.56 62.69,80.56 64.47,78.78 64.47,39.15 62.44,37.12 62.44,15.02 61.44,14.03

Small or netless copper shapes (teardrops, artwork), in the pictures only: 32 on Top Layer, 87 on Bottom Layer, 32 on Inner1, 76 on Inner2

## Text on the board
Bottom Silkscreen Layer: VIN | T04 | T08 | T12 | T00 | 0.5A | T13 | T01 | T09 | T05 | T10 | T06 | T14 | T02 | VCC | T15 | T03 | T11 | T07 | GND | + | - | gnd
Top Silkscreen Layer: 4x4 ULTRASOUND DRIVER R4 | CN1: CH0-CH15 + GND | POWER IN: 12V DC
